# EAGLE schematic aw_601_pongclock (EAGLE 6.4)
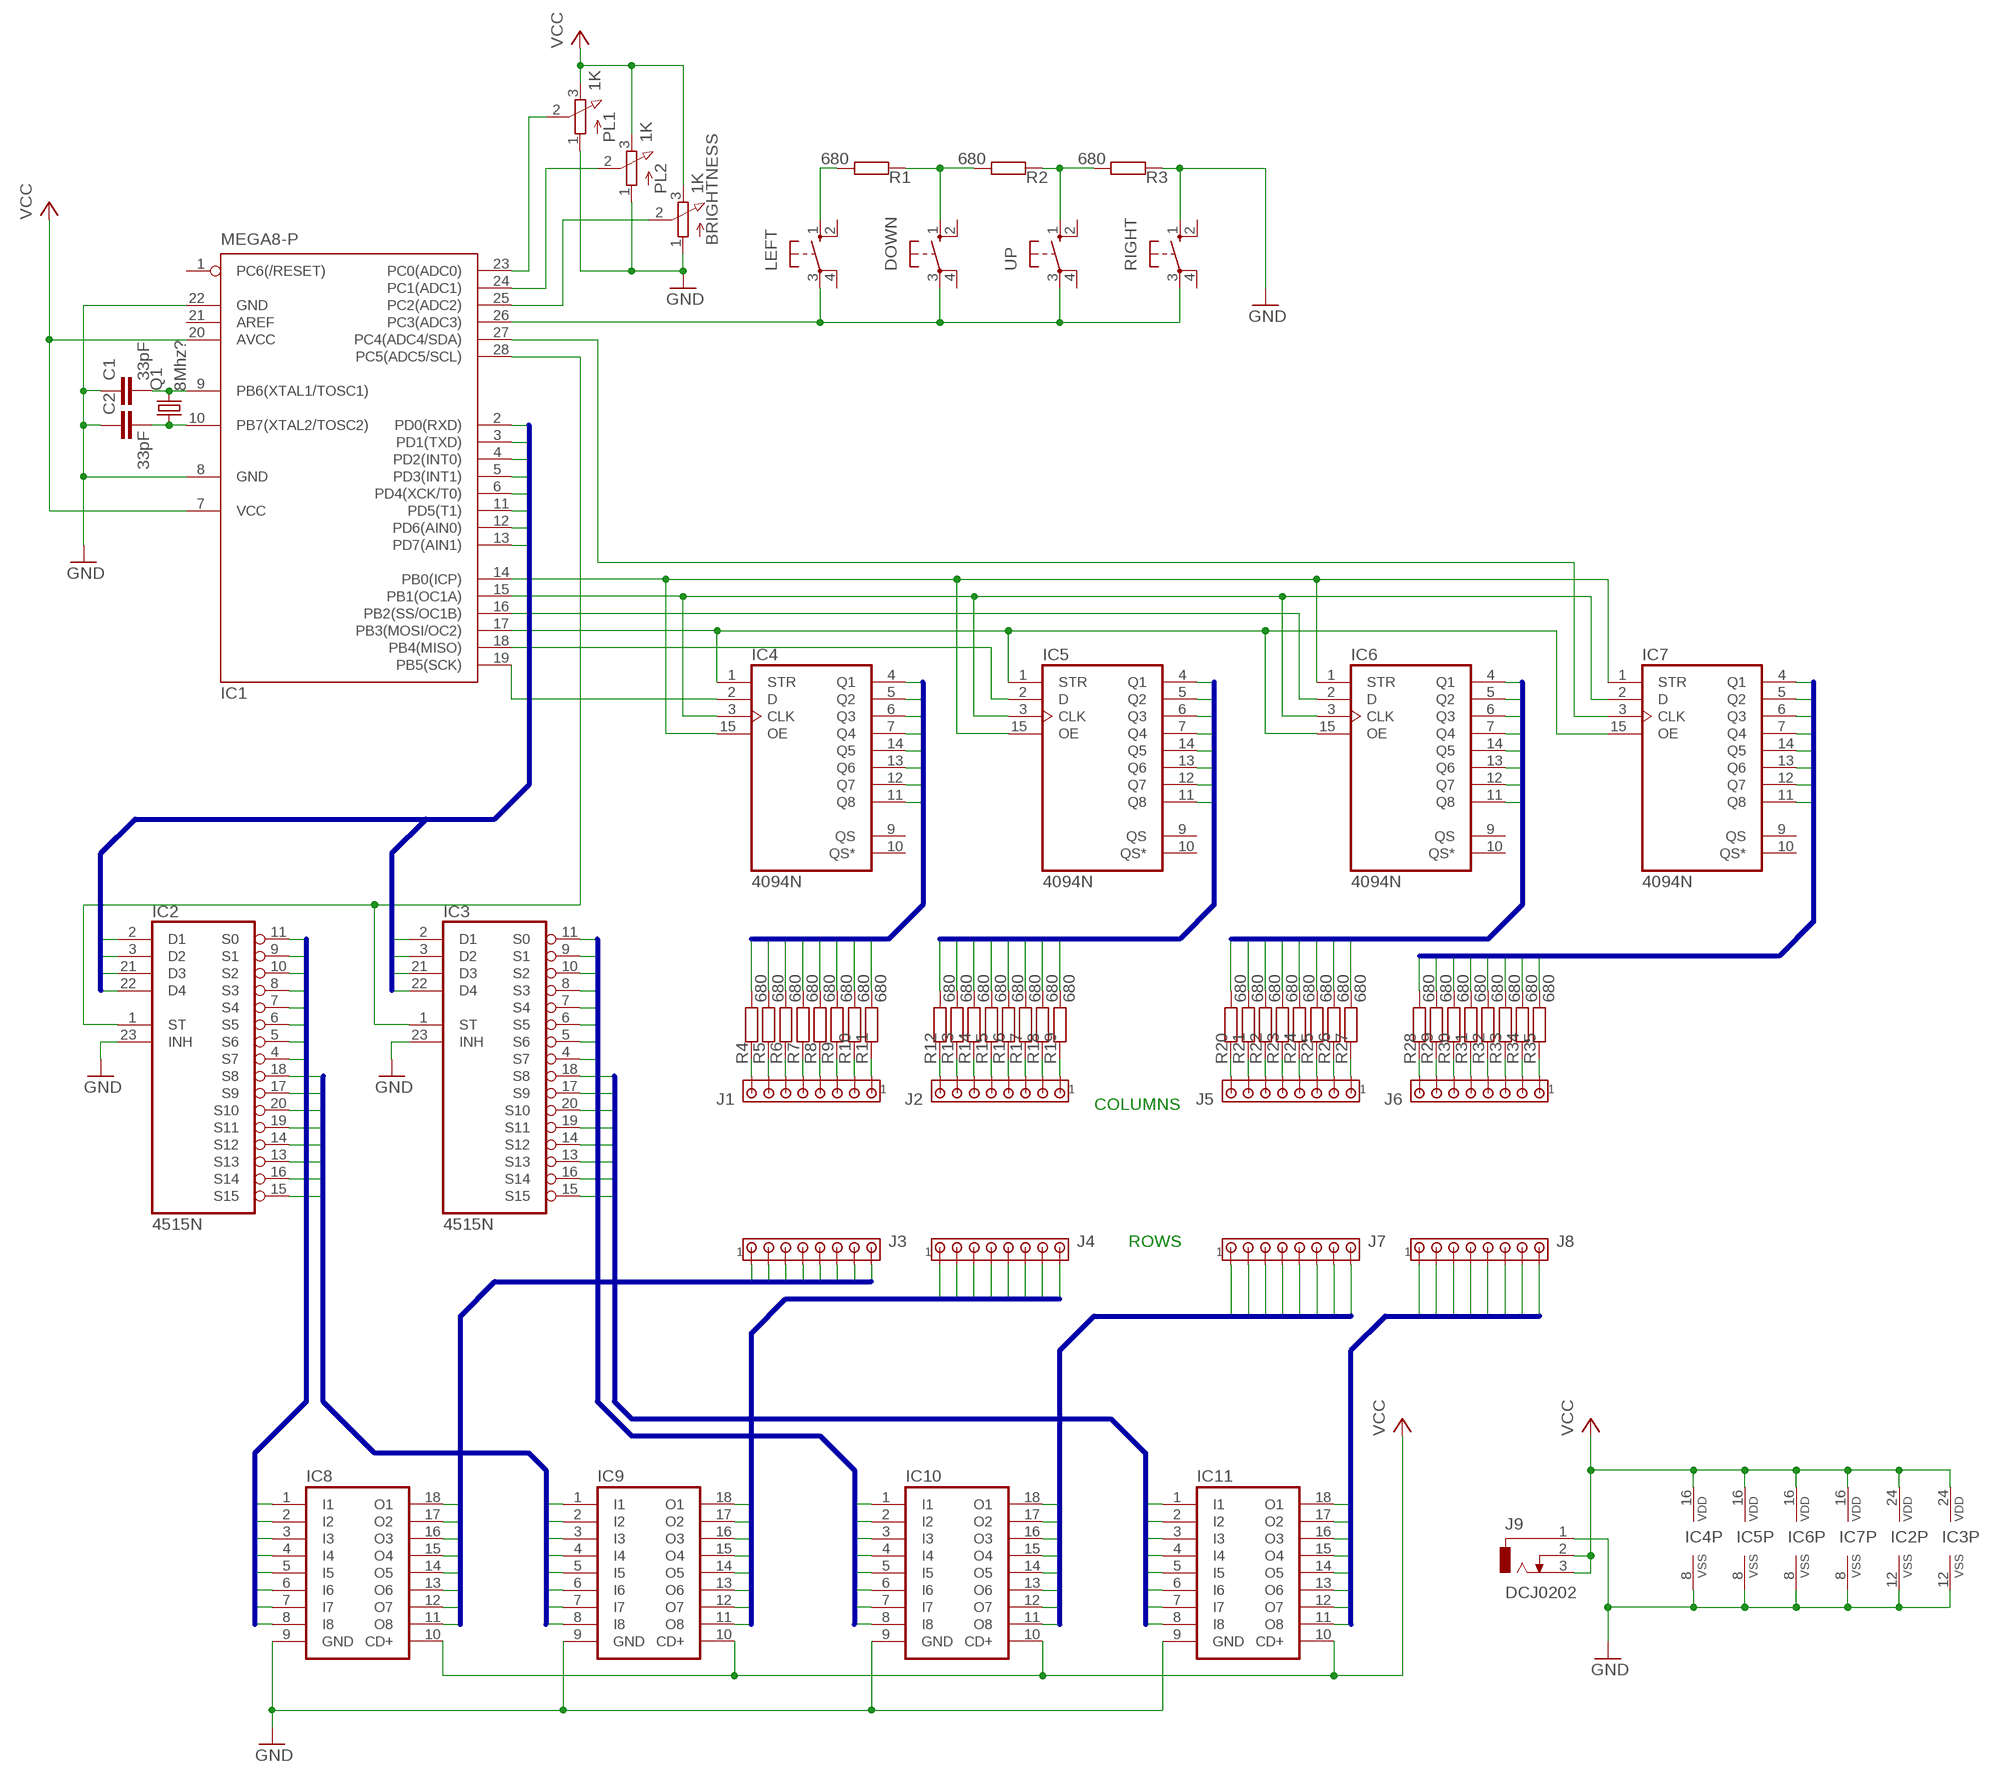
[diagram p0: schematic, sheet 1]

## Parts
BRIGHTNESS  1K  3RP/1610N  [3RP/1610N]
C1  33pF  C-EU025-025X050  [C025-025X050]
C2  33pF  C-EU025-025X050  [C025-025X050]
DOWN  40/XX  [B3F/40XX]
IC1  MEGA8-P  [DIL28-3]
IC2  4515N  [DIL24-6]
IC3  4515N  [DIL24-6]
IC4  4094N  [DIL16]
IC5  4094N  [DIL16]
IC6  4094N  [DIL16]
IC7  4094N  [DIL16]
IC8  ULN2803A  [DIL18]
IC9  ULN2803A  [DIL18]
IC10  ULN2803A  [DIL18]
IC11  ULN2803A  [DIL18]
J1  MTA08-100  [10X08MTA]
J2  MTA08-100  [10X08MTA]
J3  MTA08-100  [10X08MTA]
J4  MTA08-100  [10X08MTA]
J5  MTA08-100  [10X08MTA]
J6  MTA08-100  [10X08MTA]
J7  MTA08-100  [10X08MTA]
J8  MTA08-100  [10X08MTA]
J9  DCJ0202  [DCJ0202]
LEFT  40/XX  [B3F/40XX]
PL1  1K  3RP/1610N  [3RP/1610N]
PL2  1K  3RP/1610N  [3RP/1610N]
Q1  8Mhz?  CRYSTALHC49U70  [HC49U70]
R1  680  R-EU_0207/10  [0207/10]
R2  680  R-EU_0207/10  [0207/10]
R3  680  R-EU_0207/10  [0207/10]
R4  680  R-EU_0207/10  [0207/10]
R5  680  R-EU_0207/10  [0207/10]
R6  680  R-EU_0207/10  [0207/10]
R7  680  R-EU_0207/10  [0207/10]
R8  680  R-EU_0207/10  [0207/10]
R9  680  R-EU_0207/10  [0207/10]
R10  680  R-EU_0207/10  [0207/10]
R11  680  R-EU_0207/10  [0207/10]
R12  680  R-EU_0207/10  [0207/10]
R13  680  R-EU_0207/10  [0207/10]
R14  680  R-EU_0207/10  [0207/10]
R15  680  R-EU_0207/10  [0207/10]
R16  680  R-EU_0207/10  [0207/10]
R17  680  R-EU_0207/10  [0207/10]
R18  680  R-EU_0207/10  [0207/10]
R19  680  R-EU_0207/10  [0207/10]
R20  680  R-EU_0207/10  [0207/10]
R21  680  R-EU_0207/10  [0207/10]
R22  680  R-EU_0207/10  [0207/10]
R23  680  R-EU_0207/10  [0207/10]
R24  680  R-EU_0207/10  [0207/10]
R25  680  R-EU_0207/10  [0207/10]
R26  680  R-EU_0207/10  [0207/10]
R27  680  R-EU_0207/10  [0207/10]
R28  680  R-EU_0207/10  [0207/10]
R29  680  R-EU_0207/10  [0207/10]
R30  680  R-EU_0207/10  [0207/10]
R31  680  R-EU_0207/10  [0207/10]
R32  680  R-EU_0207/10  [0207/10]
R33  680  R-EU_0207/10  [0207/10]
R34  680  R-EU_0207/10  [0207/10]
R35  680  R-EU_0207/10  [0207/10]
RIGHT  40/XX  [B3F/40XX]
UP  40/XX  [B3F/40XX]

## Nets
CATH1_0: IC8.18(O1) J3.1
CATH1_1: IC8.17(O2) J3.2
CATH1_2: IC8.16(O3) J3.3
CATH1_3: IC8.15(O4) J3.4
CATH1_4: IC8.14(O5) J3.5
CATH1_5: IC8.13(O6) J3.6
CATH1_6: IC8.12(O7) J3.7
CATH1_7: IC8.11(O8) J3.8
CATH1B_0: IC9.18(O1) J4.1
CATH1B_1: IC9.17(O2) J4.2
CATH1B_2: IC9.16(O3) J4.3
CATH1B_3: IC9.15(O4) J4.4
CATH1B_4: IC9.14(O5) J4.5
CATH1B_5: IC9.13(O6) J4.6
CATH1B_6: IC9.12(O7) J4.7
CATH1B_7: IC9.11(O8) J4.8
CATH2_0: IC10.18(O1) J7.1
CATH2_1: IC10.17(O2) J7.2
CATH2_2: IC10.16(O3) J7.3
CATH2_3: IC10.15(O4) J7.4
CATH2_4: IC10.14(O5) J7.5
CATH2_5: IC10.13(O6) J7.6
CATH2_6: IC10.12(O7) J7.7
CATH2_7: IC10.11(O8) J7.8
CATH2B_0: IC11.18(O1) J8.1
CATH2B_1: IC11.17(O2) J8.2
CATH2B_2: IC11.16(O3) J8.3
CATH2B_3: IC11.15(O4) J8.4
CATH2B_4: IC11.14(O5) J8.5
CATH2B_5: IC11.13(O6) J8.6
CATH2B_6: IC11.12(O7) J8.7
CATH2B_7: IC11.11(O8) J8.8
GND: BRIGHTNESS.1(A) C1.1 C2.1 IC1.8(GND) IC1.22(GND) IC2.12(VSS) IC2.23(INH) IC3.12(VSS) IC3.23(INH) IC4.8(VSS) IC5.8(VSS) IC6.8(VSS) IC7.8(VSS) IC8.9(GND) IC9.9(GND) IC10.9(GND) IC11.9(GND) J9.1 PL1.1(A) PL2.1(A) R3.1 RIGHT.1(S)
LED1A1: IC2.11(S0) IC8.1(I1)
LED1A2: IC2.9(S1) IC8.2(I2)
LED1A3: IC2.10(S2) IC8.3(I3)
LED1A4: IC2.8(S3) IC8.4(I4)
LED1A5: IC2.7(S4) IC8.5(I5)
LED1A6: IC2.6(S5) IC8.6(I6)
LED1A7: IC2.5(S6) IC8.7(I7)
LED1A8: IC2.4(S7) IC8.8(I8)
LED1B1: IC2.18(S8) IC9.1(I1)
LED1B2: IC2.17(S9) IC9.2(I2)
LED1B3: IC2.20(S10) IC9.3(I3)
LED1B4: IC2.19(S11) IC9.4(I4)
LED1B5: IC2.14(S12) IC9.5(I5)
LED1B6: IC2.13(S13) IC9.6(I6)
LED1B7: IC2.16(S14) IC9.7(I7)
LED1B8: IC2.15(S15) IC9.8(I8)
LED2A1: IC3.11(S0) IC10.1(I1)
LED2A2: IC3.9(S1) IC10.2(I2)
LED2A3: IC3.10(S2) IC10.3(I3)
LED2A4: IC3.8(S3) IC10.4(I4)
LED2A5: IC3.7(S4) IC10.5(I5)
LED2A6: IC3.6(S5) IC10.6(I6)
LED2A7: IC3.5(S6) IC10.7(I7)
LED2A8: IC3.4(S7) IC10.8(I8)
LED2B1: IC3.18(S8) IC11.1(I1)
LED2B2: IC3.17(S9) IC11.2(I2)
LED2B3: IC3.20(S10) IC11.3(I3)
LED2B4: IC3.19(S11) IC11.4(I4)
LED2B5: IC3.14(S12) IC11.5(I5)
LED2B6: IC3.13(S13) IC11.6(I6)
LED2B7: IC3.16(S14) IC11.7(I7)
LED2B8: IC3.15(S15) IC11.8(I8)
LEDGND0: IC1.2(PD0(RXD)) IC2.2(D1)
LEDGND1: IC1.3(PD1(TXD)) IC2.3(D2)
LEDGND2: IC1.4(PD2(INT0)) IC2.21(D3)
LEDGND3: IC1.5(PD3(INT1)) IC2.22(D4)
LEDGND4: IC1.6(PD4(XCK/T0)) IC3.2(D1)
LEDGND5: IC1.11(PD5(T1)) IC3.3(D2)
LEDGND6: IC1.12(PD6(AIN0)) IC3.21(D3)
LEDGND7: IC1.13(PD7(AIN1)) IC3.22(D4)
N$1: IC1.14(PB0(ICP)) IC4.15(OE) IC5.15(OE) IC6.1(STR) IC7.1(STR)
N$2: LEFT.1(S) R1.2
N$3: IC1.27(PC4(ADC4/SDA)) IC7.3(CLK)
N$4: IC1.17(PB3(MOSI/OC2)) IC4.1(STR) IC5.1(STR) IC6.15(OE) IC7.15(OE)
N$5: J1.8 R4.1
N$6: J1.7 R5.1
N$7: J1.6 R6.1
N$8: J1.5 R7.1
N$9: J1.4 R8.1
N$10: J1.3 R9.1
N$11: J1.2 R10.1
N$12: J1.1 R11.1
N$13: J2.8 R12.1
N$14: J2.7 R13.1
N$15: J2.6 R14.1
N$16: J2.5 R15.1
N$17: J2.4 R16.1
N$18: J2.3 R17.1
N$19: J2.2 R18.1
N$20: J2.1 R19.1
N$21: J5.8 R20.1
N$22: J5.7 R21.1
N$23: J5.6 R22.1
N$24: J5.5 R23.1
N$25: J5.4 R24.1
N$26: J5.3 R25.1
N$27: J5.2 R26.1
N$28: J5.1 R27.1
N$29: J6.8 R28.1
N$30: J6.7 R29.1
N$31: J6.6 R30.1
N$32: J6.5 R31.1
N$33: J6.4 R32.1
N$34: J6.3 R33.1
N$35: J6.2 R34.1
N$36: J6.1 R35.1
N$37: IC1.18(PB4(MISO)) IC5.2(D)
N$38: IC1.19(PB5(SCK)) IC4.2(D)
N$39: C1.2 IC1.9(PB6(XTAL1/TOSC1)) Q1.2
N$40: C2.2 IC1.10(PB7(XTAL2/TOSC2)) Q1.1
N$41: IC1.23(PC0(ADC0)) PL1.2(S)
N$42: IC1.24(PC1(ADC1)) PL2.2(S)
N$43: BRIGHTNESS.2(S) IC1.25(PC2(ADC2))
N$44: DOWN.1(S) R1.1 R2.2
N$45: R2.1 R3.2 UP.1(S)
N$46: IC1.28(PC5(ADC5/SCL)) IC2.1(ST) IC3.1(ST)
N$48: DOWN.3(P) IC1.26(PC3(ADC3)) LEFT.3(P) RIGHT.3(P) UP.3(P)
N$51: IC1.16(PB2(SS/OC1B)) IC6.2(D)
N$52: IC1.15(PB1(OC1A)) IC4.3(CLK) IC5.3(CLK) IC6.3(CLK) IC7.2(D)
TRAN1A1: IC4.4(Q1) R4.2
TRAN1A2: IC4.5(Q2) R5.2
TRAN1A3: IC4.6(Q3) R6.2
TRAN1A4: IC4.7(Q4) R7.2
TRAN1A5: IC4.14(Q5) R8.2
TRAN1A6: IC4.13(Q6) R9.2
TRAN1A7: IC4.12(Q7) R10.2
TRAN1A8: IC4.11(Q8) R11.2
TRAN1B1: IC6.4(Q1) R20.2
TRAN1B2: IC6.5(Q2) R21.2
TRAN1B3: IC6.6(Q3) R22.2
TRAN1B4: IC6.7(Q4) R23.2
TRAN1B5: IC6.14(Q5) R24.2
TRAN1B6: IC6.13(Q6) R25.2
TRAN1B7: IC6.12(Q7) R26.2
TRAN1B8: IC6.11(Q8) R27.2
TRAN2A1: IC5.4(Q1) R12.2
TRAN2A2: IC5.5(Q2) R13.2
TRAN2A3: IC5.6(Q3) R14.2
TRAN2A4: IC5.7(Q4) R15.2
TRAN2A5: IC5.14(Q5) R16.2
TRAN2A6: IC5.13(Q6) R17.2
TRAN2A7: IC5.12(Q7) R18.2
TRAN2A8: IC5.11(Q8) R19.2
TRAN2B1: IC7.4(Q1) R28.2
TRAN2B2: IC7.5(Q2) R29.2
TRAN2B3: IC7.6(Q3) R30.2
TRAN2B4: IC7.7(Q4) R31.2
TRAN2B5: IC7.14(Q5) R32.2
TRAN2B6: IC7.13(Q6) R33.2
TRAN2B7: IC7.12(Q7) R34.2
TRAN2B8: IC7.11(Q8) R35.2
VCC: BRIGHTNESS.3(E) IC1.7(VCC) IC1.20(AVCC) IC2.24(VDD) IC3.24(VDD) IC4.16(VDD) IC5.16(VDD) IC6.16(VDD) IC7.16(VDD) IC8.10(CD+) IC9.10(CD+) IC10.10(CD+) IC11.10(CD+) J9.2 J9.3 PL1.3(E) PL2.3(E)
Unconnected: DOWN.2(S1) DOWN.4(P1) IC1.1(PC6(/RESET)) IC1.21(AREF) IC4.9(QS) IC4.10(QS*) IC5.9(QS) IC5.10(QS*) IC6.9(QS) IC6.10(QS*) IC7.9(QS) IC7.10(QS*) LEFT.2(S1) LEFT.4(P1) RIGHT.2(S1) RIGHT.4(P1) UP.2(S1) UP.4(P1)

## Buses
LED1A[1..8]
LED1B[1..8]
LED2A[1..8]
LED2B[1..8]
TRAN1A[1..8]
TRAN2A[1..8]
TRAN1B[1..8]
TRAN2B[1..8]
LEDGND[0..7]
CATH1_[0..7]
CATH2_[0..7]
CATH1B_[0..7]
CATH2B_[0..7]

## Notes on the sheet
- COLUMNS
- ROWS

## Library data of the parts
BRIGHTNESS PL1 PL2 = pot:3RP/1610N: 16mm Potentiometer one level Source: http://www.alphapotentiometers.net/html/16mm_pot_2.html
C1 C2 = rcl:C-EU: CAPACITOR, European symbol
DOWN LEFT RIGHT UP = switch-omron:40/XX: OMRON SWITCH; OC_FARNELL: unknown; OC_NEWARK: unknown
IC1 = atmel:MEGA8-P: MICROCONTROLLER 8 Kbytes FLASH, 1 kbytes SRAM, 512 bytes EEPROM, USART, 4-channel 10 bit ADC, 2-channel 8 bit ADC Pin compatible with Atmega48, ATMega88, ATMega168 Source: avr.lbr; OC_FARNELL: unknown; OC_NEWARK: unknown
IC2 IC3 = 45xx:4515: 4-bit latch 4-16 line DECODER
IC4-IC7 = 40xx:4094: 8-stage SHIFT/STORE REGISTER, tri-state
IC8-IC11 = uln-udn:ULN2803A: DRIVER ARRAY
J1-J8 = con-amp:MTA08-100: AMP connector
J9 = con-jack:DCJ0202: DC POWER JACK Source: DCJ0202.pdf; OC_FARNELL: unknown; OC_NEWARK: unknown
Q1 = crystal:CRYSTAL: CRYSTAL; OC_FARNELL: unknown; OC_NEWARK: unknown
R1-R35 = rcl:R-EU_: RESISTOR, European symbol